# Altium schematic sheet CONNECTOR_IN.SchDoc
size 420 x 297 mm; SheetNumber: 7; SheetTotal: 34
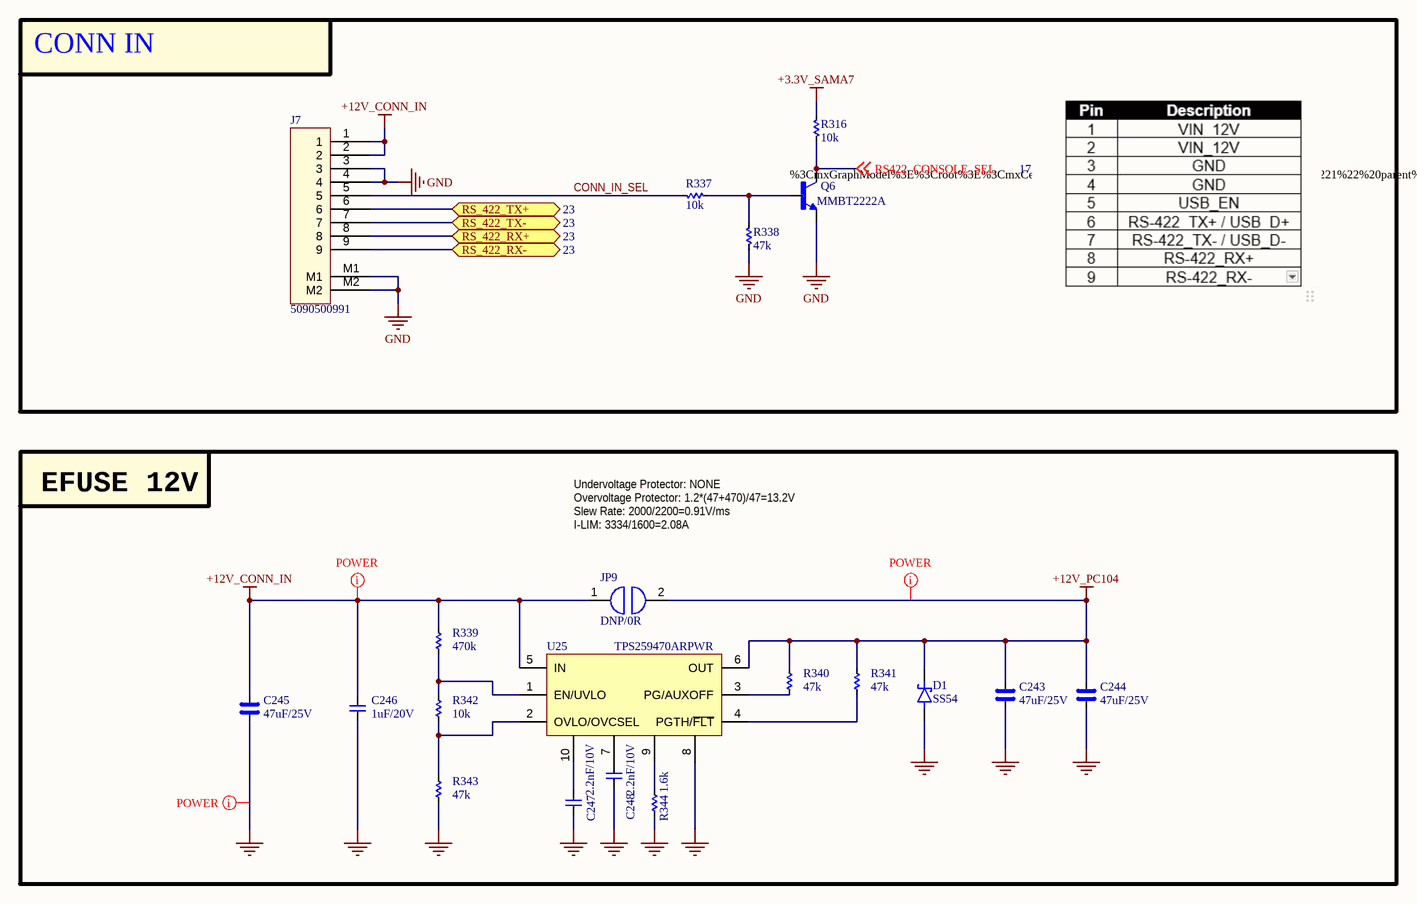
[diagram p0: CONNECTOR_IN.SchDoc]

## Parts
C243  47uF/25V  [CAP_C_3225X80]
C244  47uF/25V  [CAP_C_3225X80]
C245  47uF/25V  [CAP_C_3225X80]
C246  1uF/20V  [CAP_C_1005X50_L]
C247  2.2nF/10V  [CAP_C_1005X50_L]
C248  2.2nF/10V  [CAP_C_1005X50_L]
D1  SS54  [DO-214AC_SMA]
J7  5090500991  [MOLEX_5040500991]
JP9  DNP/0R  [JUMPER_1608]
Q6  MMBT2222A  [SOT95P240X120-3N]
R316  10k  [RES_C_1005x30_L]
R337  10k  [RES_C_1005x30_L]
R338  47k  [RES_C_1005x30_L]
R339  470k  [RES_C_1005x30_L]
R340  47k  [RES_C_1005x30_L]
R341  47k  [RES_C_1005x30_L]
R342  10k  [RES_C_1005x30_L]
R343  47k  [RES_C_1005x30_L]
R344  1.6k  [RES_C_1005x30_L]
U25  TPS259470ARPWR  [VQFN-HR-10]

## Blocks framed on the sheet
CONN IN: J7 Q6 R316 R337 R338
EFUSE 12V: C243-C248 D1 JP9 R339-R344 U25

## Ports
RS_422_RX+ (bidir, see 23), RS_422_RX- (bidir, see 23), RS_422_TX+ (bidir, see 23), RS_422_TX- (bidir, see 23)

## Nets
+3.3V_SAMA7: R316.2
+12V_CONN_IN: C245.2 C246.2 J7.1 J7.2 JP9.1 R339.2 U25.5(IN)
+12V_PC104: C243.2 C244.2 D1.1(K) JP9.2 R340.2 R341.2 U25.6(OUT)
GND: C243.1 C244.1 C245.1 C246.1 C247.1 C248.1 D1.2(A) J7.3 J7.4 J7.M1 J7.M2 Q6.2(E) R338.1 R343.1 R344.1 U25.8
CONN_IN_SEL: J7.5 R337.1
RS422_CONSOLE_SEL: Q6.3(C) R316.1 ; off-sheet RS422_CONSOLE_SEL
RS_422_RX+: J7.8 ; port RS_422_RX+
RS_422_RX-: J7.9 ; port RS_422_RX-
RS_422_TX+: J7.6 ; port RS_422_TX+
RS_422_TX-: J7.7 ; port RS_422_TX-
NetC247_2: C247.2 U25.10
NetC248_2: C248.2 U25.7
NetQ6_1: Q6.1(B) R337.2 R338.2
NetR339_1: R339.1 R342.1 U25.1(EN/UVLO)
NetR340_1: R340.1 U25.3(PG/AUXOFF)
NetR341_1: R341.1 U25.4(PGTH/~{FLT})
NetR342_2: R342.2 R343.2 U25.2(OVLO/OVCSEL)
NetR344_2: R344.2 U25.9

## Layout directives
net class POWER: +12V_CONN_IN, +12V_PC104, GND

## Notes on the sheet
- (near Q6) %3CmxGraphModel%3E%3Croot%3E%3CmxCell%20id%3D%220%22%2F%3E%3CmxCell%20id%3D%221%22%20parent%3D%220%22%2F%3E%3CmxCell%20id%3D%222%22%20parent%3D%221%22%20style%3D%22shape%3Dimage%3BverticalLabelPosition%3Dbottom%3BlabelBackgroundColor%3Ddefault%3BverticalAlign%3Dtop%3Baspect%3Dfixed%3BimageAspect%3D0%3Bimage%3Ddata%3Aimage%2Fpng%2CiVBORw0KGgoAAAANSUhEUgAAAUsAAAEoCAYAAADR19NqAAAAAXNSR0IArs4c6QAAAARnQU1BAACxjwv8YQUAAAAJcEhZcwAADsMAAA7DAcdvqGQAAChzSURBVHhe7d1RaBtX%2Fi%2Fwr%2B6F9KJI7V3WpVhurXXonwQHbruVvGQLW8mJl60vtrekenBgIz20D107m33wg82yNYsLu9KDX4zl7EOyYBU2eVBLKxVSWDeWs2w3IIn%2F5sGiZkO8ShuJUi9tI8WQwL1zH%2F4%2Bc2eORvLYkVPp6PsBQTJzNNZoRl%2FNmRmdn0PTNA1ERNTQf5MnEBFRLYYlEZENDEsiIhsYlkRENjAsiYhsYFgSEdnAsCQisoFhSURkA8OSiMgGhiURkQ0MSyIiGxiWREQ2MCyJiGxgWBIR2cCwJCKygWFJRGQDw5KIyAaGJRGRDQxLIiIbGJZERDa0TFjGYjEEg0FUq1V5FmKxGBwOh%2F44fPgw8vm83Ex55XIZkUjE8j1qllgshkgkAgBIp9NwOByIxWJyM10%2Bn8fhw4cbtpGl02l4vV6Uy2V5VlPJ%2B43D4aj5u9VqFcFgUJ9fbx8U0um05f5XLpfh9Xr15Yj3sN588ZDfN%2FGei0c6nTbN341Yn3rPy%2BfzePHFFy3f%2B0gkUvd9kqXT6Zr3qlwu48UXX6x5b1TRMmFpRWz4paUllEolaJoGTdNw5coV%2BP3%2Bmh1NdTMzMygWi%2FLkpsnn87h8%2BTKi0ag%2Bzel0Ih6PW77X1WoVU1NT2N7elme1hEKhgHA4rO83mqahWCyiu7sb2Hn9IyMj8Hq90DQNlUoFADA5OSkt6b%2BUy2WcO3dOnoxyuYwTJ05gYmICmqahVCohk8mY3jOx%2F%2BZyOdPrmZ6e1tuk02mMj4%2FrbVKpFMbHx%2FcUPpOTk1hbW5MnAzuv8%2FTp0%2Fj666%2FlWYhEIshkMvrrXFxcxIkTJywDM5%2FPY3x8XJ6M7u5uvPPOO5iammr4hdOuWjosxU67vr6u7%2BAAMDo6ilwuh7m5ubrfoLQ3IvjOnDljeq8B4KWXXsLVq1drPgCrq6sAgN7eXtP0VlCtVlEsFtHf3y%2FP0q2uriKbzeL8%2BfMAAJfLhfn5eayurloG1MzMDO7cuSNPRiKRAACEw2FgJzQWFxextLSkh02pVILD4YDH4zE9V6hWq5ifn0coFILP5wN29vNQKISFhQW5eQ1x5CpeiyydTsPj8Vi%2B%2Fnw%2Bj2QyicXFRX3bj46OIhgMYmZmxtQ2FovB7%2FfX%2FYIcHBwEDPuGSlo2LMUGnJqagsvlkmfD5%2FMhFAphfn6%2B5kNsJLqJ9bpZu80Xpwd%2B%2B9vf6m3kbpidNqLdbl0suU0sFtOPsBOJBNbW1vDMM8%2Foy5a7d3L3KRaL4bXXXtO7mnL3UNjY2MDt27cxNDQkz8Krr76K27dvY2NjwzQ9mUxaHmFA6tLVW1cjeTsYX6d4T4zL2O0UQaVSwTfffGO5PkKhUMDAwACOHj2qTzt69CiOHDmClZUVU9t0Oo1MJoMLFy6YpmNnOcFg0PQl4%2Ff7AQC5XK5uG6NKpYLNzU2EQiHT9FAohEwmY3mEJ4gj276%2BPqyursLpdJrmp9NpjI2NIRqNmnoNQqlUQldXl%2F6ahf7%2BfhSLRf3zEIvFMDMzg1QqpX8xyFwuF4aHh3f9XLajlg3LehvQKBQKYXNzU%2B8%2BydLpNPx%2BP65cuaJ3e7xeL0ZGRlCtVvX5s7Ozpm6YmC%2Bsra3h888%2F19sMDAzUdDV2axOLxTA3N6d3sXK5HMbHx00f9kgkYjrlUCqVsLS0hHg8jkwmg3A4jEAggC%2B%2F%2FBI%2Bnw%2F5fB7PP%2F88gsGgvn7BYLCm%2B%2FThhx9ieHgYmqZheXlZn260srKCI0eOmIJDOHbsGI4cOYJSqaRPK5fLKBaL%2BNGPfmRqK4Ld2KVLpVIYGxurG5j5fB6vvPKKaTsUi0X9i2t6ehrhcFj%2FAIrucDgcNnVjjXK5HG7evAm%2F31%2F3i6RQKMDr9Vp%2BGRcKBf3f4u9NTEygp6fH1G63I9hCoYBqtYqrV68ikUjUfBEK4r2yOvLc2toyvfey7u5uFItFZDIZuN1ueTZGR0druvx2GT9f09PT0DQNo6OjcjOToaEhyy%2FXdteyYWncWRtptCMlk0mEw2HTxl1eXkYmkwEAzM%2FPmz5wohuWzWZN3Yje3l79G9nlcmFqagrZbNa0MzRqUy6XsbS0hNnZWb2L5fP5MDs7q3fVyuUyMpmMqSskPgT1dvKFhQUMDAwgHo%2Fr08RrMHbHent76x4JYOcDf%2FXq1brB4Xa7MTw8jGQyqU%2FL5XLwer01R0qia%2Fv%2B%2B%2B%2BbunTGsJOJ9RCnXay2QzQaxebmJuLxuN41tDpKEsT%2Bk0qlGn6R2JFIJNDX11f3XOZuxFFjIBBApVLRvyzn5ubqHhk%2FTh6PB1tbW%2FpRsGD3MyjzeDxwOBx1P5ftqmXD8lGJ8Kn3jS92YHn%2B0aNHMTAwYAqGvr4%2By29so0Ztcrkctra2arqEQ0ND%2BhGkaGN1ZGFFHNHIAdfd3Y1gMGg6x9jotaHBe2HU39%2BvdwerhvNrskKhgK6urpr1CIVCNV8wMGyn4eFh03qI7SA%2BsN3d3ZiYmMDMzAwSiYTpS8WK1VGQ1RfJbvL5POLxOObn5y2%2FSOwwHvmJZchflt8l8V6fO3dOfy3pdHpP75OR2%2B1GX1%2FfvsO2VbVsWDb64BpZfTCNdlvObvObZXt729QldDgc8Pv9%2BPe%2F%2F6232W1drDyu1288B7exsYFvvvmm7imS3cLZyszMjOm9cbvdNVd1w%2BEwent7EQgE9AsJe7HXD3F156LX5OSk3iNopv7%2B%2FoY9o8fF5XLho48%2BQl9fn35UmEwmGx6522H3fW4XLRuW9boGRslkctcP5m4brN78ZoeQ0%2BmsuW1E0zTcv39f%2FyDu54NT7%2FXLR5yPShyxJpNJrKys4IUXXqh7ZFfvPHKjL4NoNFrz3sjn2cTV6LW1NdOph%2F2SL2DI8zY2NpDNZk1BPjY2pn%2FxxWIxuFwueL3eutvB7n7UqOsq3jf54p98MfJRuFwuZDIZ%2FX1fXl5GoVDY9fPViN11bxctG5a7Xe3e7Wr5bkcR9eaLD0gzN7QICPmDkDbcnF2vTT3iQyp%2F2Hc7%2FWCl3nshC4VCSCaTiMfjll1wNDhaqvfFVu9vl3eu8ouLQqJbmEqlEI1GMTc3V3O3gVEkEqkJE%2FmKc39%2Ff82pAeNdAT6fD%2Ffv3zeFdyqV0r%2F4RJAbT1EI4kve7%2FfrV%2FrlC1wFw9V48T4YT%2F9g530TV9HFqQXxMHbrH4XV66t3esQOO6d12pLWIqLRqBYIBLRKpaJPq1QqWiAQ0Hp7e7VSqaRPT6VSGgAtGo3q06yIdqlUSp8WjUb15cnLEX%2FP%2BDqsXlcqldKcTqeWy%2BX21Mb4%2F1KppPX29prWIRwOm9ZVvJ5wOKzPN%2F6dXC6nOZ1Ofb7VMqxemxWrdvI6iL9nXL68HlbbTN4OqVTKNF8sV34vxOuRt4v8fyvyMq2eI0%2BT328r8nuiGd4D8Tz5PdEstov8nlhNs%2FpbuxHrbVyukXH%2FF%2BT3QbN4vTJ5XzTK5XLac889t6fX3Q5aOiyN8wDoj73sQGLnEc%2BVdwB5vvxBsXpd8k5sp41oZ1wP44epXhvj6zG%2BVvFhEB9M0V5%2BHVavzYrVDi6vg1WYWAWDtvNhqre95LDULLaD%2FMGVlyHay9vLqNEyBbFOjdoYye%2BJIG8Hq9dlfE%2BM29BIBGajNo2Ida73PKuw1PbxPjQKS7v7XLtxaJqmyUeb1HmqOz%2F9Gx4ernurEtFuxH40NTW16%2F2Y7aZlz1nS4yXubbx8%2BfJ3fisLtS9xX%2Bx%2B7lZodTyyJJNYLIZCoVD3lz5E9ZTLZQwPD%2BPSpUsHcqvVd41hSURkA7vhREQ2MCyJiGxgWBIR2cCwJCKygWFJRGQDw5KIyAaGJRGRDQxLIiIbGJZERDYwLImIbGBYEhHZwLAkIrKBYUlEZENLjDrkcDjkSUSkgBaIl6bhkSURkQ0MSyIiGxiWREQ2tH1YrqysmGopGx%2F37t3D2bNn9bbr6%2BvQNA3r6%2BumZZA9Z8%2Bexb1792reZ%2FG4ePGi%2FJTvnNg%2FvvjiC5w8eVKevav19XV9vYzr34rrSger7cOyEbfbjXg8bgpMOjhvvPEGVlZW5Mlt6eTJk%2Fjiiy%2FQ398vz6IOpUxY3r17F6dOnYLD4YDD4cA777yDhw8fwu12IxAIAACOHz8Oh8OB48ePy0%2BnPbp06ZL%2BXjscDhQKBQDAT37yE8zNzcnNvzNDQ0NwOBx49tlnce3aNXn2nrz77rt48skn4XA48Oabb8qzSXHKhKUsk8ngq6%2B%2BAgD84Ac%2FACy64XNzc3jw4AEePHiAixcvmrqYqhwhPS6%2F%2BtWvcPfuXRw6dAgvv%2FyyPl3uult1h%2BVTKVZt5OXUO8XyxRdf6O3W19druuHG5aRSKcttfvbsWXzwwQfo6ekBdo6Y7927hz%2F%2B8Y91u%2BHi78vLkucbX5PVelDrUjYsg8Egnn76aQDAv%2F71L3m2yaFDh%2FDGG2%2FA7Xbr006dOlXzgaD6rl27hs8%2B%2BwwAcOzYMZw8eRJzc3O4ePGi6X3t6enBBx98oAfEysoKTp06pc8XbRKJhB6YVsupd4qlp6dHb7db%2FfPR0dGabS6H3G7qdddPnTpleW68v7%2FftL5utxt%2F%2BMMfar4cqPUoE5Y9PT345JNP9G%2Fst99%2BG4cOHcLdu3fx5z%2F%2FWW5eo1AowOFwIBwOo1KpAAB%2B%2FOMfy82oAflL6fXXX8ehQ4fwySefmLrrbrcbkUgEANDd3Q0Aehtx%2BuTpp59GMBg0LUecajl16hTu3r1rWo7w8OFDvPPOO3A4HBgaGjLNkxlP3YjTCMeOHcPdu3fx2muv4e7du8DOKYcnn3wSf%2Fvb36QlAL%2F5zW%2FQ09Nj%2BrtiHfr7%2B2u%2BcI3tPvnkEwAwrSu1LmXC0kqhULB1rurhw4d47733gJ3zUp9%2F%2FrnchPbopz%2F9KZ577jlg5yhLfImJIzARkuLoT7R5%2BeWX8cQTT%2BCJJ57A7OwsTp48iaeeegoA8PHHH%2BPatWu4du0ann32WctAvHXrFmZnZ03T6hHLA4D33nuvJqR3c%2FLkSRw7dgwA8Ne%2F%2FlX%2Fu7Ozs7h16xZg8YVrfH2ffvopHj58aJpPrUuZsJQv8Dh4IeexE%2BeG7Xjqqadw8uRJ%2FP73v9eP4GAITXEur6enB08%2B%2BaTpuc3w8OFDlEol%2Ff%2F%2F%2FOc%2F8eDBA1ObvZCPqnc7BUDtR5mwpO%2BeOFr87LPP9G4tLK6cOwxXp41HicbusOhi3717F%2Ffu3dOX1SyHDh2Cx%2BPR%2F%2F8f%2F%2FEfeOKJJ0xt9kL%2BohDvBamDYUlNsbKygv7%2Bfjx8%2BBCffvqp6XTGq6%2B%2BipMnT%2BoXQ8TVYvn%2F2Lm9SwRmd3c3rl27hm%2B%2F%2Fda0HFjc2bAfxuWJ86JfffUVMpmMqZ0chILxopbxlqm5uTk8%2F%2FzzAIC%2F%2F%2F3vpudQ%2B2JY0r688cYbpltlxBVe47k7cR5QXHz75JNP0NPTg0qlguXlZVy7dg0ff%2FwxUOe8pggaeTmijfFc837Iy4N0HlM4deoUHjx4gNdff900HQCWl5dRqVRw6NAhvP3226aLi4VCgfdjKoRhSU0hrvIaL7jMzs4iFouZLmJUKhVMTk7i3XffBQC8%2BeabuHTpkj4fhmWJoJmdncWbb76p36Ug2sRiMdsXc6yk02nTMi9duqT%2FzWvXruFPf%2FrTrhdgxI3qxtMO2Lm6z3PmitFaAAA%2B%2BHgsj7Nnz2r37t3TNE3TLl68WDOfj%2BY%2BVMIjSyIiGxiWREQ2sKwEER2YFoiXpmmZsGyBl9F0qq4XkR2q7f%2FshhMR2cCwJCKyoePCMhKJIBaLyZOphcVisZqfS8rbsFqtIhgMwuv1Wv4uO51O4%2FDhw8jn8%2Fr%2F5WWKRzqdlp9O1FlhGYvFkEgk5MnUosrlMrxeL65evYpKpaL%2FwieXy2Fubg7BYBDVatX0nDt37mBmZsY0rR6n04lcLmf6JVIul8P4%2BHhNGBN1RFiKow67HyL67lWrVZw5cwbBYBCZTAYul0uf5%2FP5cP36dWSzWayurpqeBwCJRGLfR4c%2Bnw9XrlzB3NycfhRKhE4Iy2q1ipGREWxubiKfz6O3t1duQi1oY2MDt2%2Ffxvnz5%2BVZAICjR48iFAqZRjoHgJ%2F%2F%2FOcIBAKYn5%2BvOeq0a3BwEAMDA1hYWJBnUQdTPixdLhcymQyKxSKHzWojKysrOHLkCI4ePSrPAna26%2FLycs1AvU899RTm5%2BeRzWYRj8dN8%2BxyuVzwer0oFov7DlxSj%2FJhSe1JHphiL3w%2BH0Kh0CN1peWaOkQMS2ob4oKP8cq11UUeAIhGo%2Bjq6sLU1JTlfKK9YlhSS7I6suvu7kaxWNSvXIfDYbmJrru7G4uLi1hbW9tXd%2FxRjmxJTQxLakn9%2Ff3IZrPY2NiQZ9k2OjqKcDiMpaUlU52f3VSrVRSLRQwPD5uuwlNnY1hSS2rWFeloNAoA%2BOUvfynPqmt1dRXZbLamciR1NoYltSSXy4XLly8jk8nU%2FCpHnLtMJBKYmppqePQnuuN25fN5jI%2BPY3Z2Fj6fT55NHYxhSS1LnKOcmJiAx%2BPRL%2Bp4PB4Eg0FomobR0VH5aTUGBwcRCATkydje3obf7zddMPL7%2Fbhy5Qqmp6fl5tThOETbAVJ1vYjsUG3%2F55ElEZENDEsiIhtaphtOROppgXhpmpYJyxZ4GU2n6noR2aHa%2Fs9uOBGRDQxLIiIbGJZERDZ0RFjK9VbqjVRD3x0xmr1xOxkfkUhEfoouEok03L5i2Y2W0ahNPp%2FH4cOHTTV8qPMoH5bpdBpjY2NIpVLQNA2VSgUAMDIywsBsQeFw2FQTR9upi5NMJmvq4ogQw85VV%2FHwer145plnmhJs5XIZp0%2BfRldXF27dusWfQHYw5cMymUwiHA7rP4tzuVz6SNpW9Vuo9fh8PszOzmJpaUn%2FjXi1WsXU1BRCoRCWl5dN7ePxOAYGBh55LMtyuYwTJ04AAG7cuMGR9juc8mG5vLxc82HyeDzo6uoyTaPW1t%2Ffj62tLZRKJcAwMpBVjR6Xy4Xf%2Fe53%2BOijjxoOstEIg5JkyoellVwuh62tLXg8HnkWtahCoYCuri59mxUKBQwMDNSt0RMMBvcdlKKyJBiUZNBxYVmtVjE%2FP9%2Fwg0atJZ%2FPY25uDhMTE3pwHdRI5t9%2B%2By1GRkawtraGYDDIoCRdx4Xl5OQkstks5ufn933kQQcnkUjUXAn3%2B%2F2YnZ19LMOmffjhh9jc3MSFCxeQSCRqLipR5%2BqosIxEIkgmk7h%2B%2FTqvarYo49XwUqmE3t5eBAIBTE5OmtpZ1ehpht7eXty4cQNvvfUWwuHwI1WIJLV0TFgyKNtPd3c33n%2F%2FfWSzWcuwbFSjJ51O7%2Bu%2BSGPXW1SIPH36tGmkdupMHRGWDMr2JW4bSiQSSKfT%2BvRGNXqadV5ahPXW1hZmZmbk2dRhlA%2FLWCzGoGxzk5OTCAQCOHfunH6EJ%2B6XTSaTNb%2B6aeZ5aWNY8%2FxlZ1M6LMvlMpaWlixrrTgcDu78bUIE49bWFs6cOaPfaO7z%2BfDll1%2BiWCyatmuxWMSXX35Z8%2BVodfHI4XCYjlitTE9PIxwOY2ZmhvtMB%2BN4lgdI1fUiskO1%2FV%2FpI0siomZhWBIR2dAy3XAiUk8LxEvTtExYtsDLaDpV14vIDtX2f3bDiYhsYFgSEdnQEWEpRtQW99XJNzHT42dVRsLq54lyyQjjQy4fYRSLxUxtvV5vzU8WI5FIw2WgQZtyuQyv1wuHjfs0SQ3Kh6UoCzA7O6sPzpDJZBiY36FyuYzjx4%2FD6%2FWaykFcuXIFfr%2B%2FJnwCgQAqlYqpbalUwubmZs1vxkWIXb161fSciYkJeDyemmXvhxjvcmtrC7lcTh%2BFn9SmfFgmEglgZzQb7Pzed3FxEZlMpuZIgx6PXC4H7AxUYTQ6OopwOIz5%2BfmaIzmZ2I7JZNJ0NDozM4O%2Bvr6aUdLFr3CMP5ncj2q1ipGREWSzWf6EtsMoH5bT09MoFoumQVwPauBYsqfR%2B7%2B8vIxMJmPrN91i1HRRaiKfzyOZTGJqasry%2Bb%2F%2B9a8faeRzBmVnUz4sZeL34sZRt%2BnxGhoa0st6PEq3WISkMTS7urrg9%2Fullv%2FlpZdeeqRtLgboYFB2po4JS3FBQXywRLecHj%2Bfz4fr16%2FD6XRibGzM1gUbWblcxrlz5xAKhfTganTE%2Bqh%2B8YtfIJFIPPKwb9S%2BOiYsXS4XMpkMNE3D4uIinn%2F%2B%2BZorr%2FT4%2BHw%2B3L9%2FH5qm6ecu19bW4Ha7a0b2EdONV7c9Hg%2BCwWBN5c6DsLa2hr%2F85S%2B4cOGC5UDE1Bk6JiyNGg0cS4%2Ff9PQ0NE1DpVJBIBAw1QeHdDVctOnt7a25QHRQpSacTieuX7%2BOt956y3IgYuoMHRmW1JpcLhempqZM9cFlLpcLly9fBgDT2JbYOXcpbuexIu633WvQGbveYiDi8fFx9kw6jPJhaXVTcaVSwebm5oEdiVB94txxo%2FtcjfXBrYjbhtbW1hCPx%2FXpPp8PoVCo7q1HCwsLDS8A2SHCuqurC1NTU5Z%2FhxSltYCDfBm5XE5zOp1aNBrVp4XDYa23t1crlUqmts12kOvVzlKplAbAtE00TdMqlYoWCARqtlUgENAqlYqprZjndDq1XC6nTyuVSlpvb2%2FNc6LRqAZAS6VS%2BrRGyxbqtRHrEA6HTdPp%2F1Nt%2F2%2BJtTnoN1UEJgANgOXOfxAOer3amQg1sU0A1ASf1iCsNMMyrL74wuGwadl22hgfIrAb%2FX0RwAxMa6rt%2Fxyi7QCpul5Edqi2%2Fyt%2FzpKIqBkYlkRENrRMN5yI1NMC8dI0LROWLfAymk7V9SKyQ7X9n91wIiIbGJZERDYwLImIbOi4sNzv74OpdVjV79ltmDdjzRwH6zDRPnRUWFarVUxNTWF7e1ueRW0oHA5j51do%2BsPr9eL48eOmUYvK5TJOnDiBiYkJaIY6TPJQcESNdFRYxuNxrK2tyZNJIfF4HH19fZiZmdGn1avDJA8FR9RIx4RlPp9HPB7HhQsX4HQ65dmkCDHMm7GQWaFQQDAYNJWUECMP1RvOjUjWEWEput9i0F9Sm7EmT7VaRbFYrDsc30GWoiC1dERYrq6uYnNzs2ZkbVKTx%2BNBV1eXPJnokSgflqKw1eLi4iNV9iOizqZ8WM7MzCAYDGJ0dFSeRYoqlUrY2tqSJxM9EqXDslwuI5PJIJFI6PfX%2Bf1%2BbG9vY2xsjPfaKcpYP9zlcsHr9dY9N1nvXCaRTOmw7O7uRrFYNN2Hl8vl4HQ6kUqlHksZVXq8qtUq5ufnTVe%2F%2B%2Fv7kclkTLcJiavgj1KPhzqL0mFJnWdycrLmYp64v1LceynOY09MTPA8NtnGsKS2ZTy9Ih7FYhHr6%2BumEOzu7saNGzeQyWTgcDjg8XgQDAYxPT1tWh5RIxzP8gCpul5Edqi2%2F%2FPIkojIBoYlEZENLdMNJyL1tEC8NE3LhGULvIymU3W9iOxQbf9nN5yIyAaGJRGRDR0RlrFYrOZ%2BPK%2FXy4Ff29R%2BykoI4rksK0J71RFhWSgUakoQFItF%2FnqjzcnbVKtTVsJocnKSo%2BXTvigflrsN%2FkpqsSorAUPBMlFigmivlA%2FLSqWCb775BkNDQ%2FIsUpBVWQlRsKyvrw%2Brq6ssK0L7onxY5nI53Lx5E36%2Fn%2BcrO4SxrAQMo09lMhm43W6pNZE9yoelGMcwlUrp57WCwSBOnDjBwFQUy0rQQVA%2BLKenp6FpmmmkdDF8F89fEZFdyoelFbfbjb6%2BvrqjZ1N7Y1kJOggdGZakNmNZCaJmUT4sI5FIzY3KlUoFm5ubCIVCprbU%2FqzKShA1g%2FJhef78eWSzWcTjcWDnw3TmzBn09fVhcHBQbk5tzqqsBFEzKB%2BWPp8P169fx9zcHBwOh37ryEcffQSXyyU3pzZit6wEUTNwiLYDpOp6Edmh2v6v%2FJElEVEzMCyJiGxomW44EamnBeKlaVomLFvgZTSdquulmv8s%2Fl95Uo0fetkJ2yvV9n%2BG5QFSdb1U85f1%2F4OtSv3t9D%2BdDgz%2Fr%2F8uT6ZdqLb%2FMywPkKrrpRqGZX03b97E9va2PLkup9OJF154AVBw%2F%2B%2BIvoVchoBDtLU3eXsaH%2FKvtQS5tEgkEpGbkIXt7W0cO3bM9mMvwdpulA%2FLarWKkZERYOdnjhqHaFOG3bISsVgMc3NzyOVy0DQNpVIJmUyGgUl7onxYrq6uYnNzE5cvX9Z%2FsSN%2BCpfL5aTW1O7kshLVahVXr17F7OwsfD4fsDMY8OLiomk0daLdKB%2BWyWSyZlAFMXK2cYxLUoNcVsLlciGTyWB6etrUzuPx4Pvf%2F75pGlEjSoelsViZ8ZwVz1mqTS4rYWVlZQUOh0NvS7ubnJys%2B%2BgESoelGIpNdMnEeS2es1TbbmUlyuUylpaWanoc1JgYuUtWb7pqlA5LIRwOm7phLCvRucQQfTDsB2SfHIzy%2F1XWEWEp1wxnWQm11SsrIe6M2NzcxI0bN3hUuU8iIDspKKF6WIpQpM5iVVaCQdlcnRaUUD0sXS4XhoeHcfXqVcuyEvIRJ7U%2Fq7ISDEpqBqXDEjvnKzc3N2vKSoh5pBarshJiGoOSHkVH%2FDZcHFmsra0BAAKBwGMpK3HQ69Wp5O1pJG%2FbfD6PV155pe7P8FKpFP7Hkf%2FN34bX8Y9%2F%2FAP379%2BXJ9fldDrxwx%2F%2BEFBw%2F%2B%2BIsPyuqLpequFAGgdDtf1f%2BW44EVEzMCyJiGxomW44EamnBeKlaVomLFvgZTSdqutFZIdq%2Bz%2B74URENjAsiYhsYFgSEdmgdFg2qtXiYB2WttVou9arwZNOp03tYrGY3ISoIaXDUoySLcaxFI9oNAqn04nz58%2FLT6E2YrcGTz6fx%2Fj4OFKpFDRNQy6Xw9zcHAOT9kTpsLSSz%2BcxNzdnqslC6pBr8ADAwsICBgYGMDg4CADw%2BXyYnZ2tGWCFqJGOC0vxwemUofA7jVyDBwCWl5eRyWRMYwFwLFPaq44Ky3w%2Bj2QyiampqQMfRIO%2BO7vV4OF%2BQPvRUWG5sLBQMygsqadeDZ5yuQyv1wu%2F32%2FqlhPZ0TFhWS6XkclkMDExwTENO5QogaxpGoaHh2suBBE10jFhmcvlsLW1haGhIXkWKaZeDR4jMfAzi9aRXR0TloVCAV1dXawT3QGsavAQPaqOCkvWiVafXINH3MAu%2FwBBHH2yDhPZ1RFhWa1WUSwW%2BcHoAHINHnErUSKRQDqdBnb2h6mpKV7koT3piLAU1RxJLYlEoubnjsViEevr66YexOjoKFKpFMbGxuBwOOB2u%2BH1emvuvSRqhONZHiBV14vIDtX2%2F444siQielQMSyIiG1qmG05E6mmBeGmalgnLFngZTafqehHZodr%2Bz244EZENDEsiIhs6IizFaDPiXrx6pQeoPeynrIRROp3G4cOH9fEuiexQPiyr1SrOnDmDYDAITdNQqVQAACMjI7t%2BqKi12S0rYVQul3Hu3Dl5MtGulA%2FL1dVVZLNZvd6Oy%2BXC%2FPw8bt%2B%2BjY2NDbk5tTmrshJGMzMzuHPnjjyZaFfKhyV1FquyEkI6nUYmk8GFCxdM04nsUD4sBwcHMTAwgIWFBcAwiMKRI0dw9OhRuTkpwKqshOh%2BT0xMoKenx9CayB7lw1KUw8XOfV8cREF9VmUlEokE%2Bvr6WKiO9k35sMzn8zh8%2BDD6%2B%2Fv1iwAA4PV6614EILXk83nE43HMz8%2FzC5L2TfmwtCp9K8Y6ZEkBNRnLSojTLpOTk6wTT49E%2BbDEzlGk8YjC7Xajr6%2BPtaMVZSwrsbGxgWw2i5mZGf1ezLGxMWxvb8Pv9yMWi8lPJ7LUEWFZLBYt76nkyOnqkctK%2BHw%2B3L9%2F33QvZiqVgtPpRC6Xw%2FT0tLwIIkvKh%2BX58%2BeRzWYRj8f1aaL0gKjwR%2BqQy0oQNYvyYenz%2BXDr1i0sLS3p3bBMJoMbN26weFmbs1tWgqgZOETbAVJ1vYjsUG3%2FV%2F7IkoioGRiWREQ2tEw3nIjU0wLx0jQtE5Yt8DKaTtX1IrJDtf2f3XAiIhsYlkRENjAsiYhs6IiwlGvwRCIRuQm1kf3U4IlEIrbbEllRPizL5TJOnDih1%2BARJ5wZmO3Pbg2earWKYrGIaDRqassxTWkvlA9LMQyb8bfC0WgUmUwG6XTa0JJUYFWDp1KpYHNzkwOn0CNRPiwLhYI%2BAo3AIdrUZVWDp1Qq4Xvf%2Bx78fr%2FcnMg25cOyEYalmuQaPCsrK7h58yY8Hg%2FPV9K%2BKR%2BW%2Ff39yGQypnNYoltGapJr8BQKBX38So2142mflA%2FLoaEhbG1tmc5hsXZ0Z1leXsb9%2B%2Ff1shKidnw2m8Xq6qrcnMiS8mHp8%2Flw%2Ffp1JJNJvQv2s5%2F9DIFAQG5KijDW4KlHHH3yVAzZpXxYYicwjaUFBgcHeXVUYcYaPETNonxYxmKxmrK3uVwOW1tbGBoaMrWl9ifX4BE3sMv31ZZKJWiaxn2AbFM%2BLMU5S3G%2FZblcxrlz5xAKhVgaVUFyDR5xK1EikdDvqy2Xyzh9%2BjQGBwe5D5B9Wgs46JeRy%2BU0p9OpAdAAaNFoVG5yIA56vTpVpVLRAoGAvj2Nj0AgoFUqFfkpWiqVMrULh8NyE2oy1fZ%2Fjmd5gFRdLyI7VNv%2Fle%2BGExE1A8OSiMiGlumGE5F6WiBemqZlwrIFXkbTqbpeRHaotv%2BzG05EZAPDkojIBqXDMp%2FP48UXXzT9ekdIp9OmEgMcCLh97KeshFxapF47onqUDUvxK42vv%2F5anoV0Oo3x8XF9yK5UKoXx8XF9sFhqD3bLSsilRThEG%2B2HkmGZTqfh8Xgsh2ETvx02%2FtxxdHQUoVAICwsLcnNqM1ZlJRKJBPr6%2BhCPxwHDEG23b9%2FGxsaG4dlE9SkXlul0GmNjY4hGo6a6O4IY%2BDcUCpmmh0KhmkGCqf3IZSWq1SquXr2K4eFhU3Eyn8%2BHO3fu8LfhZJtyYTk6OgpN0zA9PS3PAgyjzYjSA0ZbW1t6KQJqX8ayEsZiZcZyuDxnSXulXFgSGctKiIGAx8bGEAqFeM6S9o1hSR0hGo1idHQUYFkJ2ieGJSnHqqyEPCo%2By0rQXnVcWIpyqFbnJru6uizPZVJ7MZaVkCs9Eu1Xx4Wl2%2B1GX18fksmkaXoymdRLEVD7kstKdHd3IxgM1mxvcfQpH3ES1dNxYWlVZiCdTiOZTOL8%2BfNyc2ozclkJADh%2F%2FjySyWRNWYmBgQEMDg4ank1UX8eFJXZuL0qlUhgbG4PD4cDY2BiuXLnCe%2B7aTCKRqPm5Y7FYxPr6uqmH4PP5cOvWLZw7dw4OhwMejwfBYBCZTMZ07yVRIxyi7QCpul5Edqi2%2F3fkkSUR0V4xLImIbGiZbjgRqacF4qVpWiYsW%2BBlNJ2q60Vkh2r7P7vhREQ2MCyJiGxQPizT6XTD4bgikQhisZg8mVrYXspKyOUk5Ae3PdmldFjm83mMj4%2FLk3WxWAyJREKeTG3CTlmJ7u5uFIvFmnbhcBi9vb0Ih8PyYoksKRuWsVgMfr8f29vb8iz9yMRYeoDUYFVWQpZOp5FIJLC4uMixAMg2JcMyFothZmYGqVSq5sihWq1iZGQEm5ubyOfz6O3tNc2n9iaXlZCJgTbC4bA%2BviWRHUqG5fT0NDRNs%2FwwuFwuZDIZFItFHlUoylhWQra6uopsNstBU2jPlAxL6mz1xrAUR5UDAwM4evSoPJuoIYYldYyNjQ1ks1lMTU1xtCHaM4YlKceqrAQArKys6COoE%2B0Vw5KUYywrYVQoFNDX1we3222aTmQHw5KUIpeVME4vFosYHh5mF5z2hWFJSrEqKwEAlUoFm5ubrLlD%2B8awpLZlt6wEGpzHJLKLQ7QdIFXXi8gO1fZ%2FHlkSEdnAsCQisqFluuFEpJ4WiJemaYmwJCJqdeyGExHZwLAkIrKBYUlEZAPDkojIBoYlEZENDEsiIhsYlkRENjAsiYhsYFgSEdnAsCQisoFhSURkA8OSiMiG%2Fwengy82j7CVogAAAABJRU5ErkJggg%3D%3D%3B%22%20value%3D%22%22%20vertex%3D%221%22%3E%3CmxGeometry%20height%3D%22285.5%22%20width%3D%22319.25%22%20x%3D%222420%22%20y%3D%223560%22%20as%3D%22geometry%22%2F%3E%3C%2FmxCell%3E%3C%2Froot%3E%3C%2FmxGraphModel%3E
- Undervoltage Protector: NONE
- Overvoltage Protector: 1.2*(47+470)/47=13.2V
- Slew Rate: 2000/2200=0.91V/ms
- I-LIM: 3334/1600=2.08A
- Project:
- Sub-system:
- Design by:
- Sheet title:
- Sheet
- of
- Checked by:
- Approved by:
- Revision:
- Document No:
- Size:
- Date:
- A3

## Library data of the parts
C243-C245 = _CAP_C_High_2: CAP High Value
C246-C248 = _CAP_C_2: CAP
D1 = DIODE SCHOTTKY
J7 = Header 9x1_2M
JP9 = JUMPER
Q6 = BJT_NPN_BEC: MF: Diotec Semiconductor; SnapEDA_Link: https://www.snapeda.com/parts/MMBT2222A/Diotec/view-part/?ref=snap; Package: SOT-23 Diotec; Value: *; MP: MMBT2222A; Check_prices: https://www.snapeda.com/parts/MMBT2222A/Diotec/view-part/?ref=eda
R316 R337-R344 = _RES_B_2: RES